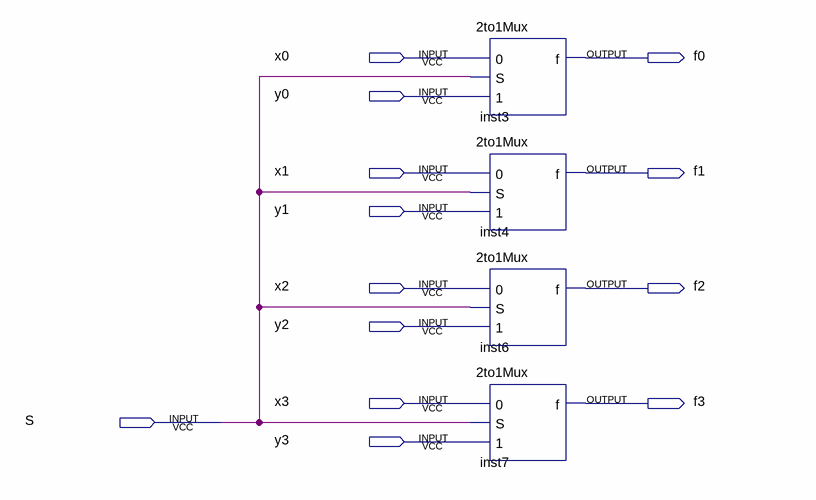
[diagram p0: schematic sheet]
// Quartus schematic 4Muxes.bdf as structural Verilog: 4 symbols, 13 pins
module \4Muxes  (
  input  x0,
  input  y0,
  input  x1,
  input  y1,
  input  x2,
  input  y2,
  input  x3,
  input  S,
  input  y3,
  output f0,
  output f1,
  output f2,
  output f3
);

  \2to1Mux  inst3 (.\0 (x0), .S(S), .\1 (y0), .f(f0));
  \2to1Mux  inst4 (.\0 (x1), .S(S), .\1 (y1), .f(f1));
  \2to1Mux  inst6 (.\0 (x2), .S(S), .\1 (y2), .f(f2));
  \2to1Mux  inst7 (.\0 (x3), .S(S), .\1 (y3), .f(f3));
endmodule
